# EAGLE schematic Erolf (EAGLE 6.5.0)

## Sheet 1 of 13
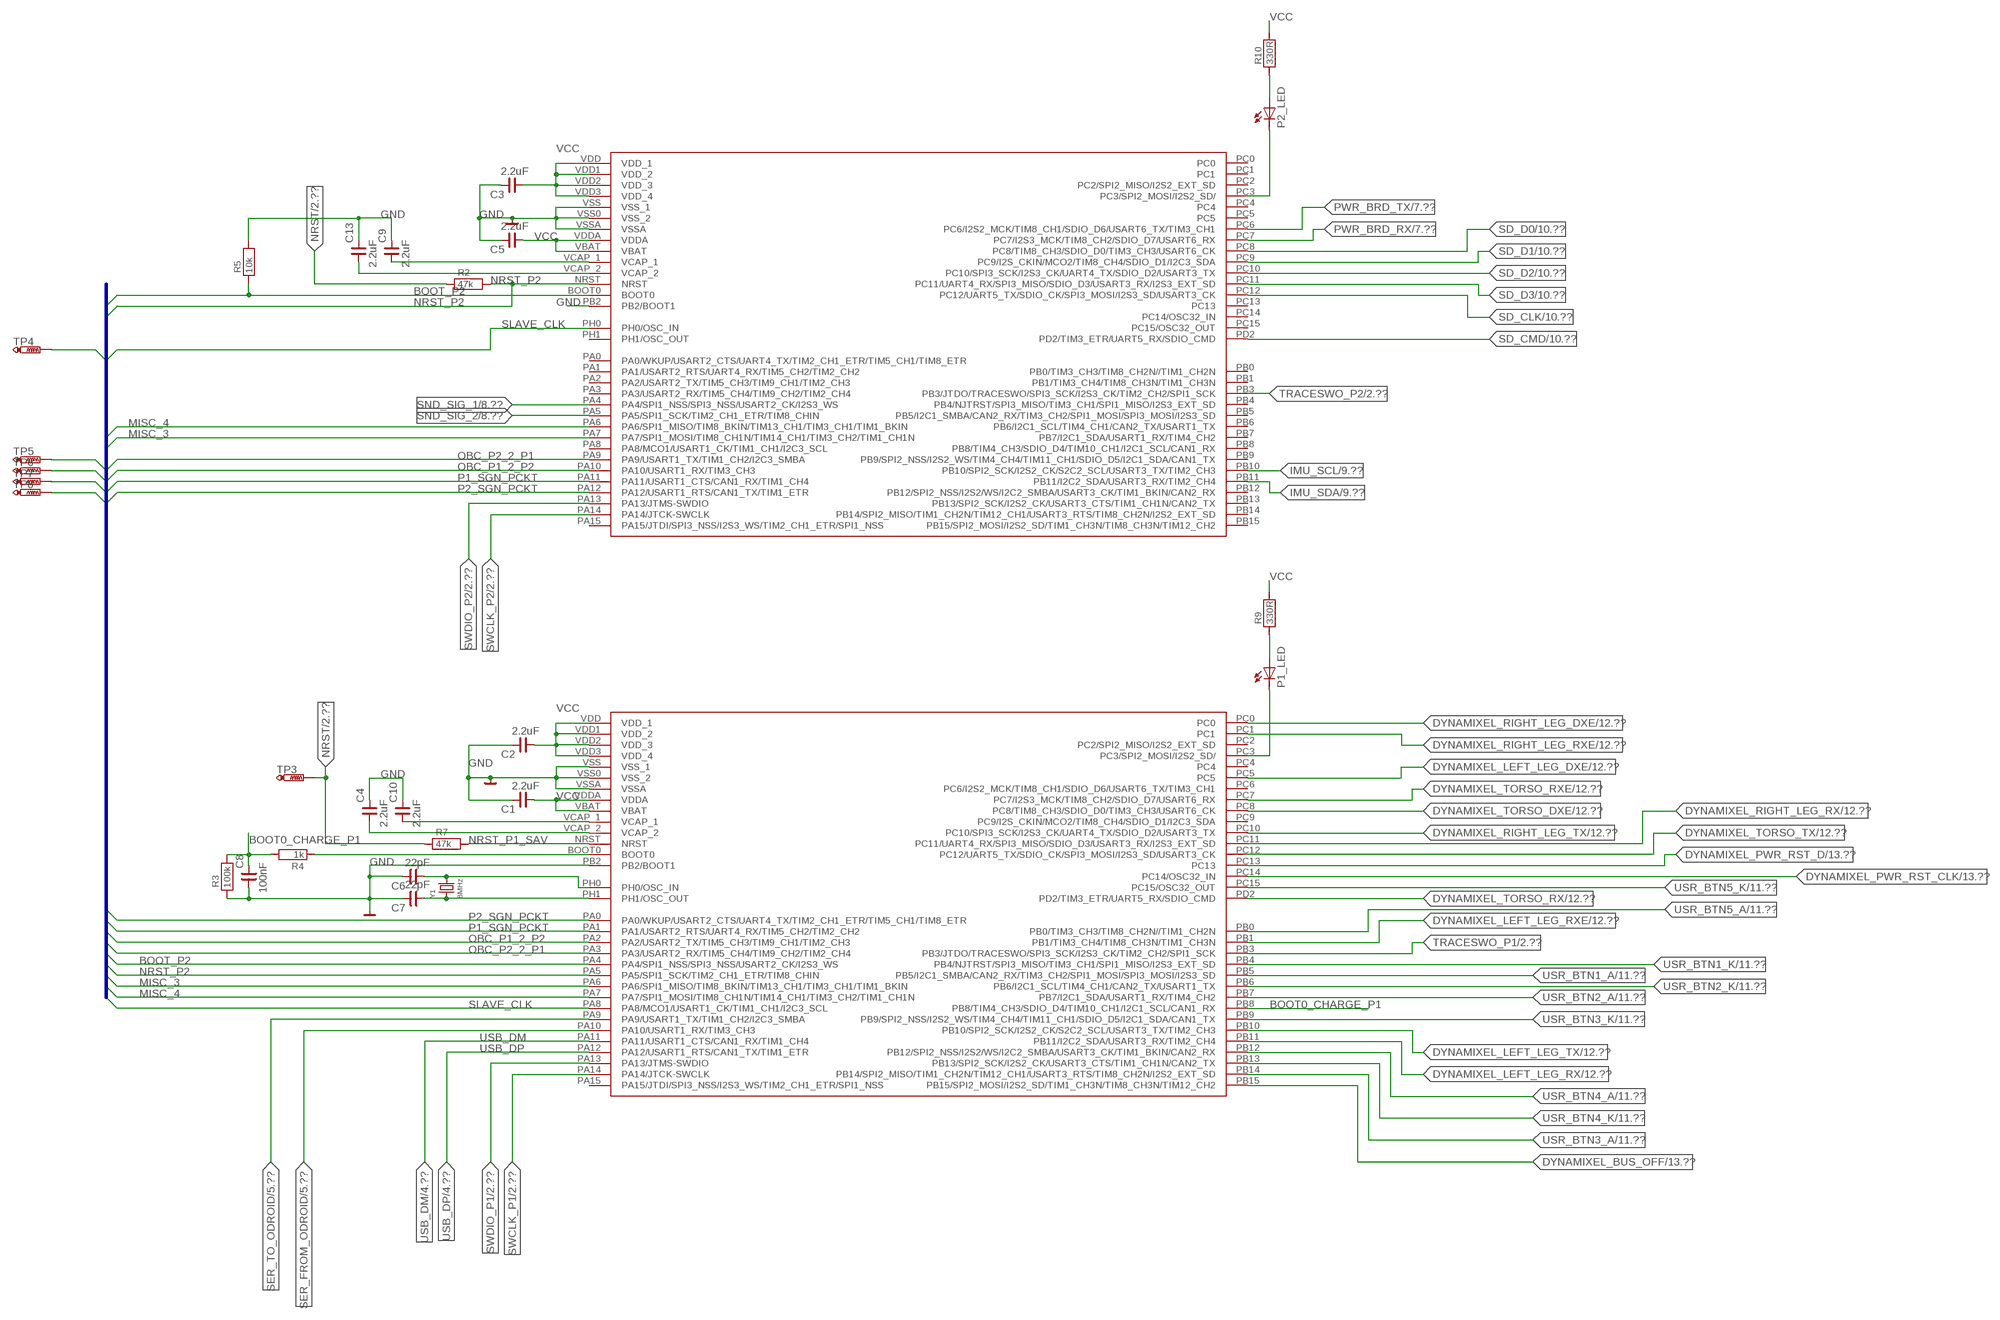
[diagram p0: schematic, sheet 1]

### Parts
C1  2.2uF  C_0603  [C0603]
C2  2.2uF  C_0603  [C0603]
C3  2.2uF  C_0603  [C0603]
C4  2.2uF  C_0603  [C0603]
C5  2.2uF  C_0603  [C0603]
C6  22pF  C_0603  [C0603]
C7  22pF  C_0603  [C0603]
C8  100nF  C_0603  [C0603]
C9  2.2uF  C_0603  [C0603]
C10  2.2uF  C_0603  [C0603]
C13  2.2uF  C_0603  [C0603]
P1_LED  LEDCHIP-LED0805  [CHIP-LED0805]
P2_LED  LEDCHIP-LED0805  [CHIP-LED0805]
PROCESSOR_1  STM32-F405RB  [LQFP-64]
PROCESSOR_2  STM32-F405RB  [LQFP-64]
R2  47k  R0603  [R0603]
R3  100k  R0603  [R0603]
R4  1k  R0603  [R0603]
R5  10k  R0603  [R0603]
R7  47k  R0603  [R0603]
R9  330R  R0603  [R0603]
R10  330R  R0603  [R0603]
TP3  PTR1TP06R  [TP06R]
TP4  PTR1TP06R  [TP06R]
TP5  PTR1TP06R  [TP06R]
TP6  PTR1TP06R  [TP06R]
TP7  PTR1TP06R  [TP06R]
TP8  PTR1TP06R  [TP06R]
Y1  8MHz  CRYSTALTHIN32K  [CRYSTAL_4.9X1.8]

### Nets
BOOT0_CHARGE_P1: C8.2 PROCESSOR_1.PB8(PB8/TIM4_CH3/SDIO_D4/TIM10_CH1/I2C1_SCL/CAN1_RX) R3.2 R4.2
BOOT_P2: PROCESSOR_1.PA4(PA4/SPI1_NSS/SPI3_NSS/USART2_CK/I2S3_WS) PROCESSOR_2.BOOT0 R5.1
DYNAMIXEL_BUS_OFF: PROCESSOR_1.PB15(PB15/SPI2_MOSI/I2S2_SD/TIM1_CH3N/TIM8_CH3N/TIM12_CH2) ; also sheet 13
DYNAMIXEL_LEFT_LEG_DXE: PROCESSOR_1.PC5 ; also sheet 12
DYNAMIXEL_LEFT_LEG_RX: PROCESSOR_1.PB11(PB11/I2C2_SDA/USART3_RX/TIM2_CH4) ; also sheet 12
DYNAMIXEL_LEFT_LEG_RXE: PROCESSOR_1.PB1(PB1/TIM3_CH4/TIM8_CH3N/TIM1_CH3N) ; also sheet 12
DYNAMIXEL_LEFT_LEG_TX: PROCESSOR_1.PB10(PB10/SPI2_SCK/I2S2_CK/S2C2_SCL/USART3_TX/TIM2_CH3) ; also sheet 12
DYNAMIXEL_PWR_RST_CLK: PROCESSOR_1.PC14(PC14/OSC32_IN) ; also sheet 13
DYNAMIXEL_PWR_RST_D: PROCESSOR_1.PC13 ; also sheet 13
DYNAMIXEL_RIGHT_LEG_DXE: PROCESSOR_1.PC0 ; also sheet 12
DYNAMIXEL_RIGHT_LEG_RX: PROCESSOR_1.PC11(PC11/UART4_RX/SPI3_MISO/SDIO_D3/USART3_RX/I2S3_EXT_SD) ; also sheet 12
DYNAMIXEL_RIGHT_LEG_RXE: PROCESSOR_1.PC1 ; also sheet 12
DYNAMIXEL_RIGHT_LEG_TX: PROCESSOR_1.PC10(PC10/SPI3_SCK/I2S3_CK/UART4_TX/SDIO_D2/USART3_TX) ; also sheet 12
DYNAMIXEL_TORSO_DXE: PROCESSOR_1.PC8(PC8/TIM8_CH3/SDIO_D0/TIM3_CH3/USART6_CK) ; also sheet 12
DYNAMIXEL_TORSO_RX: PROCESSOR_1.PD2(PD2/TIM3_ETR/UART5_RX/SDIO_CMD) ; also sheet 12
DYNAMIXEL_TORSO_RXE: PROCESSOR_1.PC7(PC7/I2S3_MCK/TIM8_CH2/SDIO_D7/USART6_RX) ; also sheet 12
DYNAMIXEL_TORSO_TX: PROCESSOR_1.PC12(PC12/UART5_TX/SDIO_CK/SPI3_MOSI/I2S3_SD/USART3_CK) ; also sheet 12
GND: C1.2 C2.2 C3.2 C4.2 C5.2 C6.2 C7.2 C8.1 C9.2 C10.2 C13.2 PROCESSOR_1.PB2(PB2/BOOT1) PROCESSOR_1.VSS0(VSS_2) PROCESSOR_1.VSS(VSS_1) PROCESSOR_1.VSSA PROCESSOR_2.PB2(PB2/BOOT1) PROCESSOR_2.VSS0(VSS_2) PROCESSOR_2.VSS(VSS_1) PROCESSOR_2.VSSA R3.1 R5.2 ; supply symbol labelled VG ; also sheet 2,4,5,6,7,9,10,12,13
IMU_SCL: PROCESSOR_2.PB10(PB10/SPI2_SCK/I2S2_CK/S2C2_SCL/USART3_TX/TIM2_CH3) ; also sheet 9
IMU_SDA: PROCESSOR_2.PB11(PB11/I2C2_SDA/USART3_RX/TIM2_CH4) ; also sheet 9
MISC_3: PROCESSOR_1.PA6(PA6/SPI1_MISO/TIM8_BKIN/TIM13_CH1/TIM3_CH1/TIM1_BKIN) PROCESSOR_2.PA7(PA7/SPI1_MOSI/TIM8_CH1N/TIM14_CH1/TIM3_CH2/TIM1_CH1N)
MISC_4: PROCESSOR_1.PA7(PA7/SPI1_MOSI/TIM8_CH1N/TIM14_CH1/TIM3_CH2/TIM1_CH1N) PROCESSOR_2.PA6(PA6/SPI1_MISO/TIM8_BKIN/TIM13_CH1/TIM3_CH1/TIM1_BKIN)
N$1: C10.1 PROCESSOR_1.VCAP_1
N$3: P1_LED.A R9.1
N$4: P2_LED.A R10.1
N$5: P1_LED.C PROCESSOR_1.PC3(PC3/SPI2_MOSI/I2S2_SD/)
N$7: C13.1 PROCESSOR_2.VCAP_2
N$8: C9.1 PROCESSOR_2.VCAP_1
N$9: PROCESSOR_1.BOOT0 R4.1
N$10: P2_LED.C PROCESSOR_2.PC3(PC3/SPI2_MOSI/I2S2_SD/)
N$43: C4.1 PROCESSOR_1.VCAP_2
NRST: R2.1 R7.1 TP3.TP ; also sheet 2,6
NRST_P1_SAV: PROCESSOR_1.NRST R7.2
NRST_P2: PROCESSOR_1.PA5(PA5/SPI1_SCK/TIM2_CH1_ETR/TIM8_CHIN) PROCESSOR_2.NRST R2.2
OBC_P1_2_P2: PROCESSOR_1.PA2(PA2/USART2_TX/TIM5_CH3/TIM9_CH1/TIM2_CH3) PROCESSOR_2.PA10(PA10/USART1_RX/TIM3_CH3) TP6.TP
OBC_P2_2_P1: PROCESSOR_1.PA3(PA3/USART2_RX/TIM5_CH4/TIM9_CH2/TIM2_CH4) PROCESSOR_2.PA9(PA9/USART1_TX/TIM1_CH2/I2C3_SMBA) TP5.TP
OSC_IN: C6.1 PROCESSOR_1.PH0(PH0/OSC_IN) Y1.2
OSC_OUT: C7.1 PROCESSOR_1.PH1(PH1/OSC_OUT) Y1.1
P1_SGN_PCKT: PROCESSOR_1.PA1(PA1/USART2_RTS/UART4_RX/TIM5_CH2/TIM2_CH2) PROCESSOR_2.PA11(PA11/USART1_CTS/CAN1_RX/TIM1_CH4) TP7.TP
P2_SGN_PCKT: PROCESSOR_1.PA0(PA0/WKUP/USART2_CTS/UART4_TX/TIM2_CH1_ETR/TIM5_CH1/TIM8_ETR) PROCESSOR_2.PA12(PA12/USART1_RTS/CAN1_TX/TIM1_ETR) TP8.TP
PWR_BRD_RX: PROCESSOR_2.PC7(PC7/I2S3_MCK/TIM8_CH2/SDIO_D7/USART6_RX) ; also sheet 7
PWR_BRD_TX: PROCESSOR_2.PC6(PC6/I2S2_MCK/TIM8_CH1/SDIO_D6/USART6_TX/TIM3_CH1) ; also sheet 7
SD_CLK: PROCESSOR_2.PC12(PC12/UART5_TX/SDIO_CK/SPI3_MOSI/I2S3_SD/USART3_CK) ; also sheet 10
SD_CMD: PROCESSOR_2.PD2(PD2/TIM3_ETR/UART5_RX/SDIO_CMD) ; also sheet 10
SD_D0: PROCESSOR_2.PC8(PC8/TIM8_CH3/SDIO_D0/TIM3_CH3/USART6_CK) ; also sheet 10
SD_D1: PROCESSOR_2.PC9(PC9/I2S_CKIN/MCO2/TIM8_CH4/SDIO_D1/I2C3_SDA) ; also sheet 10
SD_D2: PROCESSOR_2.PC10(PC10/SPI3_SCK/I2S3_CK/UART4_TX/SDIO_D2/USART3_TX) ; also sheet 10
SD_D3: PROCESSOR_2.PC11(PC11/UART4_RX/SPI3_MISO/SDIO_D3/USART3_RX/I2S3_EXT_SD) ; also sheet 10
SER_FROM_ODROID: PROCESSOR_1.PA10(PA10/USART1_RX/TIM3_CH3) ; also sheet 5
SER_TO_ODROID: PROCESSOR_1.PA9(PA9/USART1_TX/TIM1_CH2/I2C3_SMBA) ; also sheet 5
SLAVE_CLK: PROCESSOR_1.PA8(PA8/MCO1/USART1_CK/TIM1_CH1/I2C3_SCL) PROCESSOR_2.PH0(PH0/OSC_IN) TP4.TP
SND_SIG_1: PROCESSOR_2.PA4(PA4/SPI1_NSS/SPI3_NSS/USART2_CK/I2S3_WS) ; also sheet 8
SND_SIG_2: PROCESSOR_2.PA5(PA5/SPI1_SCK/TIM2_CH1_ETR/TIM8_CHIN) ; also sheet 8
SWCLK_P1: PROCESSOR_1.PA14(PA14/JTCK-SWCLK) ; also sheet 2
SWCLK_P2: PROCESSOR_2.PA14(PA14/JTCK-SWCLK) ; also sheet 2
SWDIO_P1: PROCESSOR_1.PA13(PA13/JTMS-SWDIO) ; also sheet 2
SWDIO_P2: PROCESSOR_2.PA13(PA13/JTMS-SWDIO) ; also sheet 2
TRACESWO_P1: PROCESSOR_1.PB3(PB3/JTDO/TRACESWO/SPI3_SCK/I2S3_CK/TIM2_CH2/SPI1_SCK) ; also sheet 2
TRACESWO_P2: PROCESSOR_2.PB3(PB3/JTDO/TRACESWO/SPI3_SCK/I2S3_CK/TIM2_CH2/SPI1_SCK) ; also sheet 2
USB_DM: PROCESSOR_1.PA11(PA11/USART1_CTS/CAN1_RX/TIM1_CH4) ; also sheet 4
USB_DP: PROCESSOR_1.PA12(PA12/USART1_RTS/CAN1_TX/TIM1_ETR) ; also sheet 4
USR_BTN1_A: PROCESSOR_1.PB5(PB5/I2C1_SMBA/CAN2_RX/TIM3_CH2/SPI1_MOSI/SPI3_MOSI/I2S3_SD) ; also sheet 11
USR_BTN1_K: PROCESSOR_1.PB4(PB4/NJTRST/SPI3_MISO/TIM3_CH1/SPI1_MISO/I2S3_EXT_SD) ; also sheet 11
USR_BTN2_A: PROCESSOR_1.PB7(PB7/I2C1_SDA/USART1_RX/TIM4_CH2) ; also sheet 11
USR_BTN2_K: PROCESSOR_1.PB6(PB6/I2C1_SCL/TIM4_CH1/CAN2_TX/USART1_TX) ; also sheet 11
USR_BTN3_A: PROCESSOR_1.PB14(PB14/SPI2_MISO/TIM1_CH2N/TIM12_CH1/USART3_RTS/TIM8_CH2N/I2S2_EXT_SD) ; also sheet 11
USR_BTN3_K: PROCESSOR_1.PB9(PB9/SPI2_NSS/I2S2_WS/TIM4_CH4/TIM11_CH1/SDIO_D5/I2C1_SDA/CAN1_TX) ; also sheet 11
USR_BTN4_A: PROCESSOR_1.PB12(PB12/SPI2_NSS/I2S2/WS/I2C2_SMBA/USART3_CK/TIM1_BKIN/CAN2_RX) ; also sheet 11
USR_BTN4_K: PROCESSOR_1.PB13(PB13/SPI2_SCK/I2S2_CK/USART3_CTS/TIM1_CH1N/CAN2_TX) ; also sheet 11
USR_BTN5_A: PROCESSOR_1.PB0(PB0/TIM3_CH3/TIM8_CH2N//TIM1_CH2N) ; also sheet 11
USR_BTN5_K: PROCESSOR_1.PC15(PC15/OSC32_OUT) ; also sheet 11
VCC: C1.1 C2.1 C3.1 C5.1 PROCESSOR_1.VBAT PROCESSOR_1.VDD1(VDD_2) PROCESSOR_1.VDD2(VDD_3) PROCESSOR_1.VDD3(VDD_4) PROCESSOR_1.VDD(VDD_1) PROCESSOR_1.VDDA PROCESSOR_2.VBAT PROCESSOR_2.VDD1(VDD_2) PROCESSOR_2.VDD2(VDD_3) PROCESSOR_2.VDD3(VDD_4) PROCESSOR_2.VDD(VDD_1) PROCESSOR_2.VDDA R9.2 R10.2 ; also sheet 2,5,6,7,9,10,11,12,13
Unconnected: PROCESSOR_1.PA15(PA15/JTDI/SPI3_NSS/I2S3_WS/TIM2_CH1_ETR/SPI1_NSS) PROCESSOR_1.PC2(PC2/SPI2_MISO/I2S2_EXT_SD) PROCESSOR_1.PC4 PROCESSOR_1.PC6(PC6/I2S2_MCK/TIM8_CH1/SDIO_D6/USART6_TX/TIM3_CH1) PROCESSOR_1.PC9(PC9/I2S_CKIN/MCO2/TIM8_CH4/SDIO_D1/I2C3_SDA) PROCESSOR_2.PA0(PA0/WKUP/USART2_CTS/UART4_TX/TIM2_CH1_ETR/TIM5_CH1/TIM8_ETR) PROCESSOR_2.PA1(PA1/USART2_RTS/UART4_RX/TIM5_CH2/TIM2_CH2) PROCESSOR_2.PA2(PA2/USART2_TX/TIM5_CH3/TIM9_CH1/TIM2_CH3) PROCESSOR_2.PA3(PA3/USART2_RX/TIM5_CH4/TIM9_CH2/TIM2_CH4) PROCESSOR_2.PA8(PA8/MCO1/USART1_CK/TIM1_CH1/I2C3_SCL) PROCESSOR_2.PA15(PA15/JTDI/SPI3_NSS/I2S3_WS/TIM2_CH1_ETR/SPI1_NSS) PROCESSOR_2.PB0(PB0/TIM3_CH3/TIM8_CH2N//TIM1_CH2N) PROCESSOR_2.PB1(PB1/TIM3_CH4/TIM8_CH3N/TIM1_CH3N) PROCESSOR_2.PB4(PB4/NJTRST/SPI3_MISO/TIM3_CH1/SPI1_MISO/I2S3_EXT_SD) PROCESSOR_2.PB5(PB5/I2C1_SMBA/CAN2_RX/TIM3_CH2/SPI1_MOSI/SPI3_MOSI/I2S3_SD) PROCESSOR_2.PB6(PB6/I2C1_SCL/TIM4_CH1/CAN2_TX/USART1_TX) PROCESSOR_2.PB7(PB7/I2C1_SDA/USART1_RX/TIM4_CH2) PROCESSOR_2.PB8(PB8/TIM4_CH3/SDIO_D4/TIM10_CH1/I2C1_SCL/CAN1_RX) PROCESSOR_2.PB9(PB9/SPI2_NSS/I2S2_WS/TIM4_CH4/TIM11_CH1/SDIO_D5/I2C1_SDA/CAN1_TX) PROCESSOR_2.PB12(PB12/SPI2_NSS/I2S2/WS/I2C2_SMBA/USART3_CK/TIM1_BKIN/CAN2_RX) PROCESSOR_2.PB13(PB13/SPI2_SCK/I2S2_CK/USART3_CTS/TIM1_CH1N/CAN2_TX) PROCESSOR_2.PB14(PB14/SPI2_MISO/TIM1_CH2N/TIM12_CH1/USART3_RTS/TIM8_CH2N/I2S2_EXT_SD) PROCESSOR_2.PB15(PB15/SPI2_MOSI/I2S2_SD/TIM1_CH3N/TIM8_CH3N/TIM12_CH2) PROCESSOR_2.PC0 PROCESSOR_2.PC1 PROCESSOR_2.PC2(PC2/SPI2_MISO/I2S2_EXT_SD) PROCESSOR_2.PC4 PROCESSOR_2.PC5 PROCESSOR_2.PC13 PROCESSOR_2.PC14(PC14/OSC32_IN) PROCESSOR_2.PC15(PC15/OSC32_OUT) PROCESSOR_2.PH1(PH1/OSC_OUT)

### Buses
SLAVE_CLK,OBC_P1_2_P2,OBC_P2_2_P1,P1_SGN_PCKT,P2_SGN_PCKT,MISC_1,MISC_2,MISC_3,MISC_4,MISC_5,MISC_6,MISC_7,MISC_8,MISC_9,MISC_10,NRST_P2,BOOT_P2

## Sheet 2 of 13
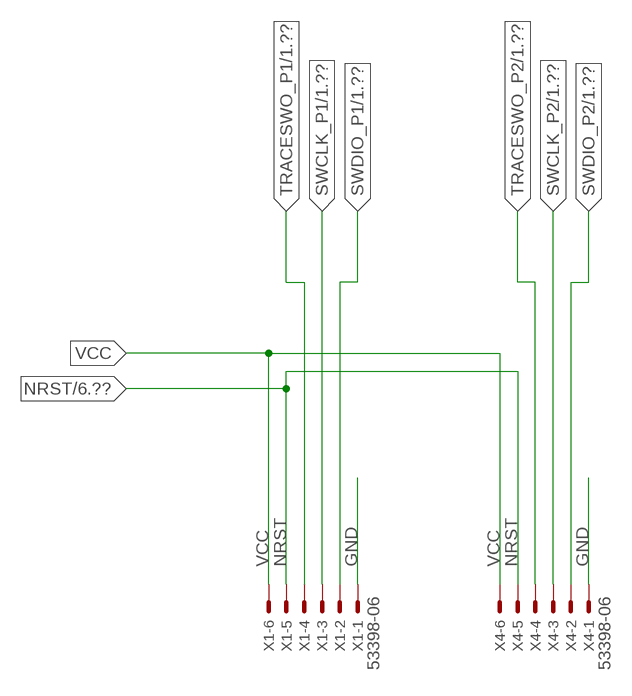
[diagram p1: schematic, sheet 2]

### Parts
X1  53398-06  [53398-06]
X4  53398-06  [53398-06]

### Nets
GND: X1.1 X4.1 ; also sheet 1,4,5,6,7,9,10,12,13
NRST: X1.5 X4.5 ; also sheet 1,6
SWCLK_P1: X1.3 ; also sheet 1
SWCLK_P2: X4.3 ; also sheet 1
SWDIO_P1: X1.2 ; also sheet 1
SWDIO_P2: X4.2 ; also sheet 1
TRACESWO_P1: X1.4 ; also sheet 1
TRACESWO_P2: X4.4 ; also sheet 1
VCC: X1.6 X4.6 ; also sheet 1,5,6,7,9,10,11,12,13

## Sheet 3 of 13
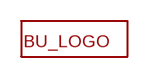
[diagram p2: schematic, sheet 3]

### Parts
U$8  LOGO  [LOGO]

## Sheet 4 of 13
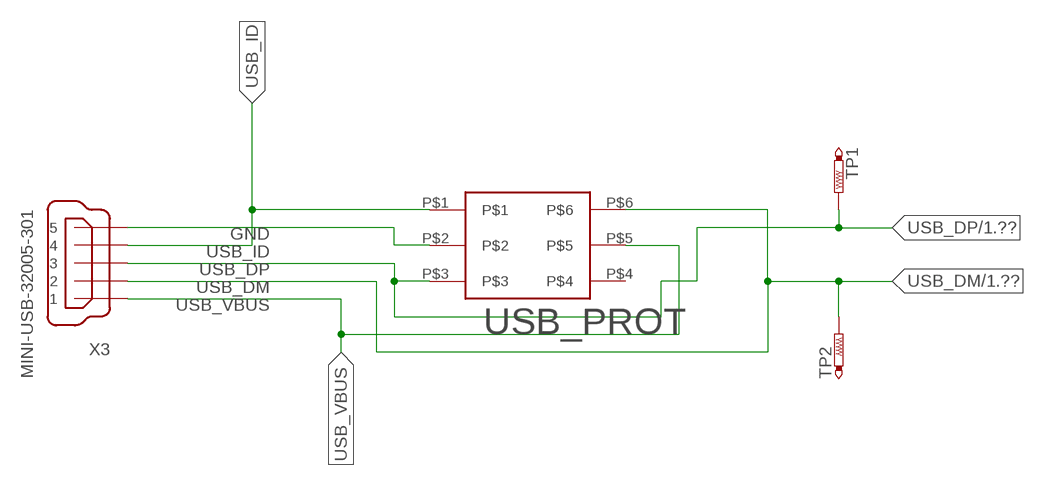
[diagram p3: schematic, sheet 4]

### Parts
TP1  PTR1TP06R  [TP06R]
TP2  PTR1TP06R  [TP06R]
USB_PROT  VBUS054B  [LLP75-6L]
X3  MINI-USB-32005-301  [32005-301]

### Nets
GND: USB_PROT.P$2 X3.5 ; also sheet 1,2,5,6,7,9,10,12,13
USB_DM: TP2.TP USB_PROT.P$6 X3.2 ; also sheet 1
USB_DP: TP1.TP USB_PROT.P$3 X3.3 ; also sheet 1
USB_ID: USB_PROT.P$1 X3.4
USB_VBUS: USB_PROT.P$5 X3.1
Unconnected: USB_PROT.P$4

## Sheet 5 of 13
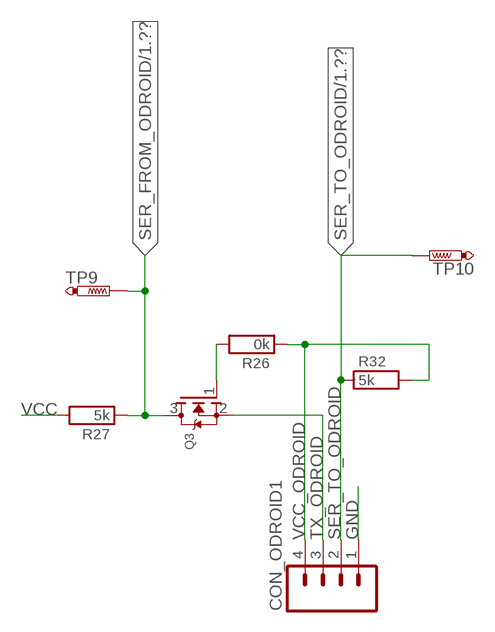
[diagram p4: schematic, sheet 5]

### Parts
CON_ODROID1  M04  [04P]
Q3  MOSFET-NREFLOW  [SOT23]
R26  0k  R0603  [R0603]
R27  5k  R0603  [R0603]
R32  5k  R0603  [R0603]
TP9  PTR1TP06R  [TP06R]
TP10  PTR1TP06R  [TP06R]

### Nets
GND: CON_ODROID1.1 ; also sheet 1,2,4,6,7,9,10,12,13
N$15: Q3.1(G) R26.2
SER_FROM_ODROID: Q3.3(D) R27.1 TP9.TP ; also sheet 1
SER_TO_ODROID: CON_ODROID1.2 R32.1 TP10.TP ; also sheet 1
TX_ODROID: CON_ODROID1.3 Q3.2(S)
VCC: R27.2 ; also sheet 1,2,6,7,9,10,11,12,13
VCC_ODROID: CON_ODROID1.4 R26.1 R32.2

## Sheet 6 of 13
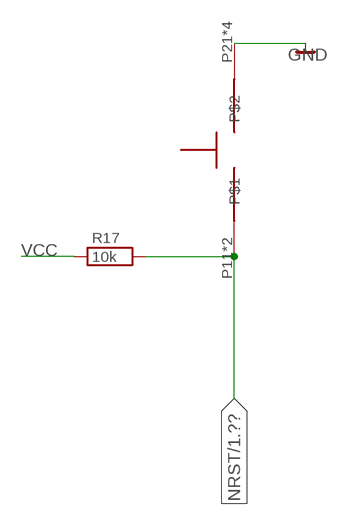
[diagram p5: schematic, sheet 6]

### Parts
R17  10k  R0603  [R0603]
U$3  BUTTON  [BUTTON]

### Nets
GND: U$3.P21 U$3.P22 U$3.P23 U$3.P24 ; supply symbol labelled VG ; also sheet 1,2,4,5,7,9,10,12,13
NRST: R17.2 U$3.P11 U$3.P12 ; also sheet 1,2
VCC: R17.1 ; also sheet 1,2,5,7,9,10,11,12,13

## Sheet 7 of 13
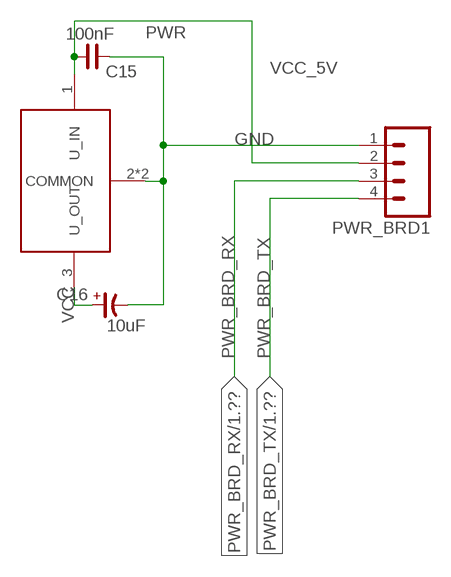
[diagram p6: schematic, sheet 7]

### Parts
BLUBB  UA78M00  [SOT223-4]
C15  100nF  C_0603  [C0603]
C16  10uF  CP_E-025X060  [CE-025X060]
PWR_BRD1  M04  [04P]

### Nets
GND: BLUBB.2(COMMON) BLUBB.4(COMMON) C15.2 C16.- PWR_BRD1.1 ; also sheet 1,2,4,5,6,9,10,12,13
PWR_BRD_RX: PWR_BRD1.3 ; also sheet 1
PWR_BRD_TX: PWR_BRD1.4 ; also sheet 1
VCC: BLUBB.3(U_OUT) C16.+ ; also sheet 1,2,5,6,9,10,11,12,13
VCC_5V: BLUBB.1(U_IN) C15.1 PWR_BRD1.2 ; also sheet 8

### Notes on the sheet
- PWR

## Sheet 8 of 13
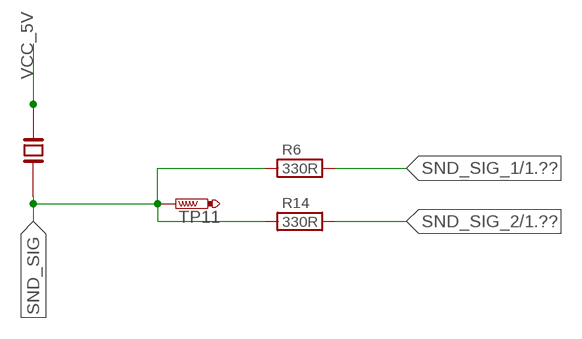
[diagram p7: schematic, sheet 8]

### Parts
R6  330R  R0603  [R0603]
R14  330R  R0603  [R0603]
TP11  PTR1TP06R  [TP06R]
U$1  PS1240P02CT3  [PS1240P02CT3]

### Nets
SND_SIG: R6.1 R14.1 TP11.TP U$1.P$2
SND_SIG_1: R6.2 ; also sheet 1
SND_SIG_2: R14.2 ; also sheet 1
VCC_5V: U$1.P$1 ; also sheet 7

## Sheet 9 of 13
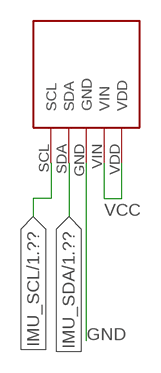
[diagram p8: schematic, sheet 9]

### Parts
U$4  MINI-IMU-9V2  [PCB]

### Nets
GND: U$4.GND ; also sheet 1,2,4,5,6,7,10,12,13
IMU_SCL: U$4.SCL ; also sheet 1
IMU_SDA: U$4.SDA ; also sheet 1
VCC: U$4.VDD U$4.VIN ; also sheet 1,2,5,6,7,10,11,12,13

## Sheet 10 of 13
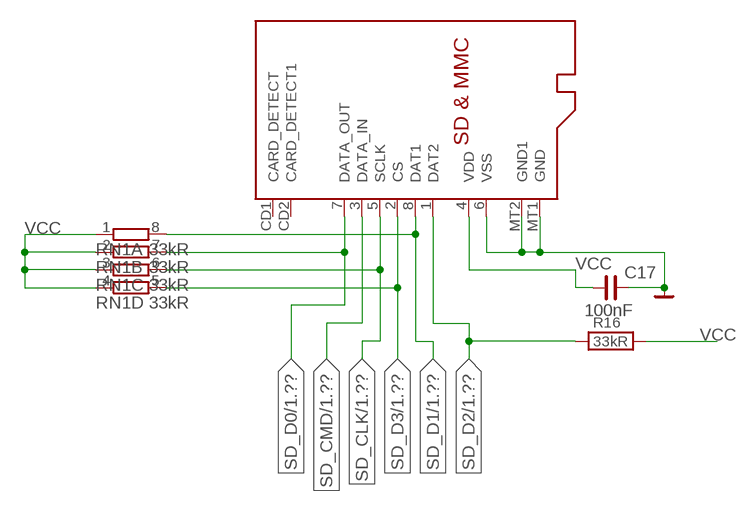
[diagram p9: schematic, sheet 10]

### Parts
C17  100nF  C_0603  [C0603]
R16  33kR  R0603  [R0603]
RN1  33kR  4R-NEXBS8V  [EXBS8V]
U$2  MICROSD  [MICROSD]

### Nets
GND: C17.2 U$2.6(VSS) U$2.MT1(GND) U$2.MT2(GND1) ; supply symbol labelled VG ; also sheet 1,2,4,5,6,7,9,12,13
SD_CLK: RN1.6 U$2.5(SCLK) ; also sheet 1
SD_CMD: U$2.3(DATA_IN) ; also sheet 1
SD_D0: RN1.7 U$2.7(DATA_OUT) ; also sheet 1
SD_D1: RN1.8 U$2.8(DAT1) ; also sheet 1
SD_D2: R16.1 U$2.1(DAT2) ; also sheet 1
SD_D3: RN1.5 U$2.2(CS) ; also sheet 1
VCC: C17.1 R16.2 RN1.1 RN1.2 RN1.3 RN1.4 U$2.4(VDD) ; also sheet 1,2,5,6,7,9,11,12,13
Unconnected: U$2.CD1(CARD_DETECT) U$2.CD2(CARD_DETECT1)

## Sheet 11 of 13
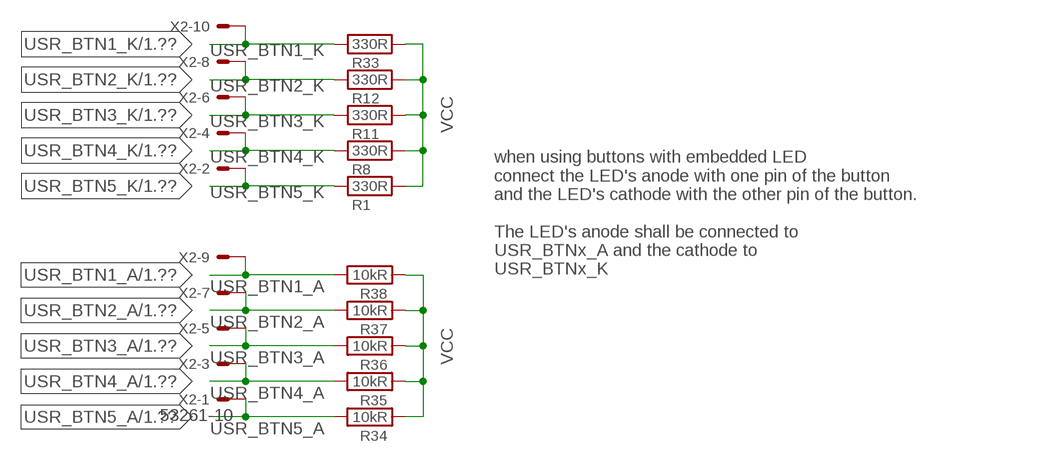
[diagram p10: schematic, sheet 11]

### Parts
R1  330R  R0603  [R0603]
R8  330R  R0603  [R0603]
R11  330R  R0603  [R0603]
R12  330R  R0603  [R0603]
R33  330R  R0603  [R0603]
R34  10kR  R0603  [R0603]
R35  10kR  R0603  [R0603]
R36  10kR  R0603  [R0603]
R37  10kR  R0603  [R0603]
R38  10kR  R0603  [R0603]
X2  53261-10  [53261-10]

### Nets
USR_BTN1_A: R38.2 X2.9 ; also sheet 1
USR_BTN1_K: R33.1 X2.10 ; also sheet 1
USR_BTN2_A: R37.2 X2.7 ; also sheet 1
USR_BTN2_K: R12.1 X2.8 ; also sheet 1
USR_BTN3_A: R36.2 X2.5 ; also sheet 1
USR_BTN3_K: R11.1 X2.6 ; also sheet 1
USR_BTN4_A: R35.2 X2.3 ; also sheet 1
USR_BTN4_K: R8.1 X2.4 ; also sheet 1
USR_BTN5_A: R34.2 X2.1 ; also sheet 1
USR_BTN5_K: R1.1 X2.2 ; also sheet 1
VCC: R1.2 R8.2 R11.2 R12.2 R33.2 R34.1 R35.1 R36.1 R37.1 R38.1 ; also sheet 1,2,5,6,7,9,10,12,13

### Notes on the sheet
- when using buttons with embedded LED 
  connect the LED's anode with one pin of the button
  and the LED's cathode with the other pin of the button.
  
  The LED's anode shall be connected to 
  USR_BTNx_A and the cathode to
  USR_BTNx_K

## Sheet 12 of 13
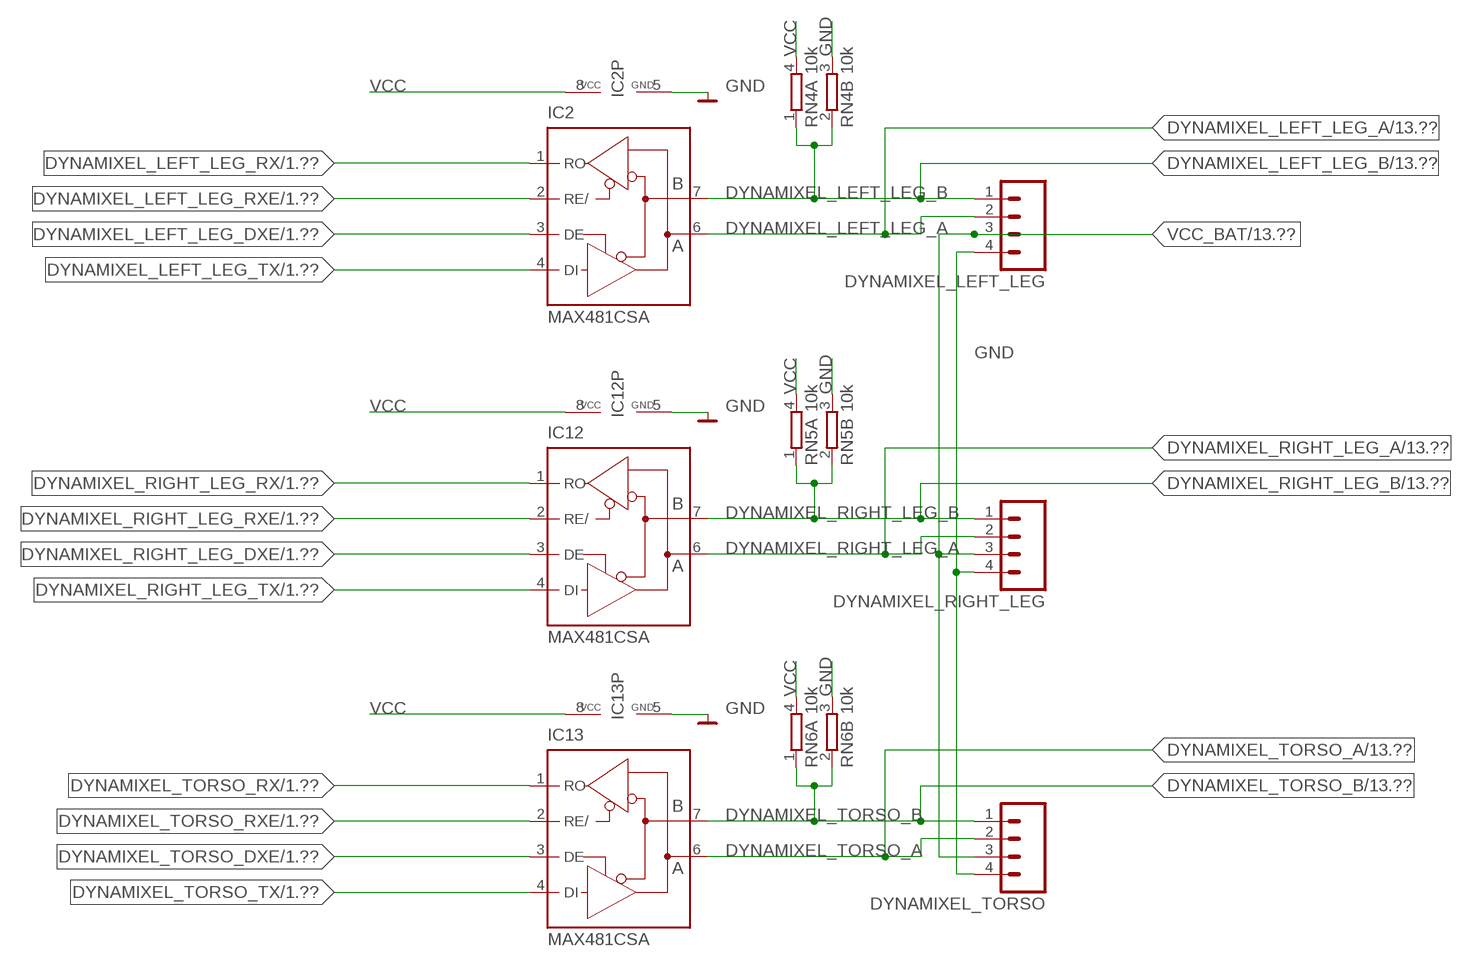
[diagram p11: schematic, sheet 12]

### Parts
DYNAMIXEL_LEFT_LEG  M04  [04P]
DYNAMIXEL_RIGHT_LEG  M04  [04P]
DYNAMIXEL_TORSO  M04  [04P]
IC2  MAX481CSA  [SO08]
IC12  MAX481CSA  [SO08]
IC13  MAX481CSA  [SO08]
RN4  10k  2R-NEXBV4V  [EXBV4V]
RN5  10k  2R-NEXBV4V  [EXBV4V]
RN6  10k  2R-NEXBV4V  [EXBV4V]

### Nets
DYNAMIXEL_LEFT_LEG_A: DYNAMIXEL_LEFT_LEG.2 IC2.6(A) ; also sheet 13
DYNAMIXEL_LEFT_LEG_B: DYNAMIXEL_LEFT_LEG.1 IC2.7(B) RN4.1 RN4.2 ; also sheet 13
DYNAMIXEL_LEFT_LEG_DXE: IC2.3(DE) ; also sheet 1
DYNAMIXEL_LEFT_LEG_RX: IC2.1(RO) ; also sheet 1
DYNAMIXEL_LEFT_LEG_RXE: IC2.2(RE/) ; also sheet 1
DYNAMIXEL_LEFT_LEG_TX: IC2.4(DI) ; also sheet 1
DYNAMIXEL_RIGHT_LEG_A: DYNAMIXEL_RIGHT_LEG.2 IC12.6(A) ; also sheet 13
DYNAMIXEL_RIGHT_LEG_B: DYNAMIXEL_RIGHT_LEG.1 IC12.7(B) RN5.1 RN5.2 ; also sheet 13
DYNAMIXEL_RIGHT_LEG_DXE: IC12.3(DE) ; also sheet 1
DYNAMIXEL_RIGHT_LEG_RX: IC12.1(RO) ; also sheet 1
DYNAMIXEL_RIGHT_LEG_RXE: IC12.2(RE/) ; also sheet 1
DYNAMIXEL_RIGHT_LEG_TX: IC12.4(DI) ; also sheet 1
DYNAMIXEL_TORSO_A: DYNAMIXEL_TORSO.2 IC13.6(A) ; also sheet 13
DYNAMIXEL_TORSO_B: DYNAMIXEL_TORSO.1 IC13.7(B) RN6.1 RN6.2 ; also sheet 13
DYNAMIXEL_TORSO_DXE: IC13.3(DE) ; also sheet 1
DYNAMIXEL_TORSO_RX: IC13.1(RO) ; also sheet 1
DYNAMIXEL_TORSO_RXE: IC13.2(RE/) ; also sheet 1
DYNAMIXEL_TORSO_TX: IC13.4(DI) ; also sheet 1
GND: DYNAMIXEL_LEFT_LEG.4 DYNAMIXEL_RIGHT_LEG.4 DYNAMIXEL_TORSO.4 IC2.5(GND) IC12.5(GND) IC13.5(GND) RN4.3 RN5.3 RN6.3 ; supply symbol labelled VG ; also sheet 1,2,4,5,6,7,9,10,13
VCC: IC2.8(VCC) IC12.8(VCC) IC13.8(VCC) RN4.4 RN5.4 RN6.4 ; also sheet 1,2,5,6,7,9,10,11,13
VCC_BAT: DYNAMIXEL_LEFT_LEG.3 DYNAMIXEL_RIGHT_LEG.3 DYNAMIXEL_TORSO.3 ; also sheet 13

## Sheet 13 of 13
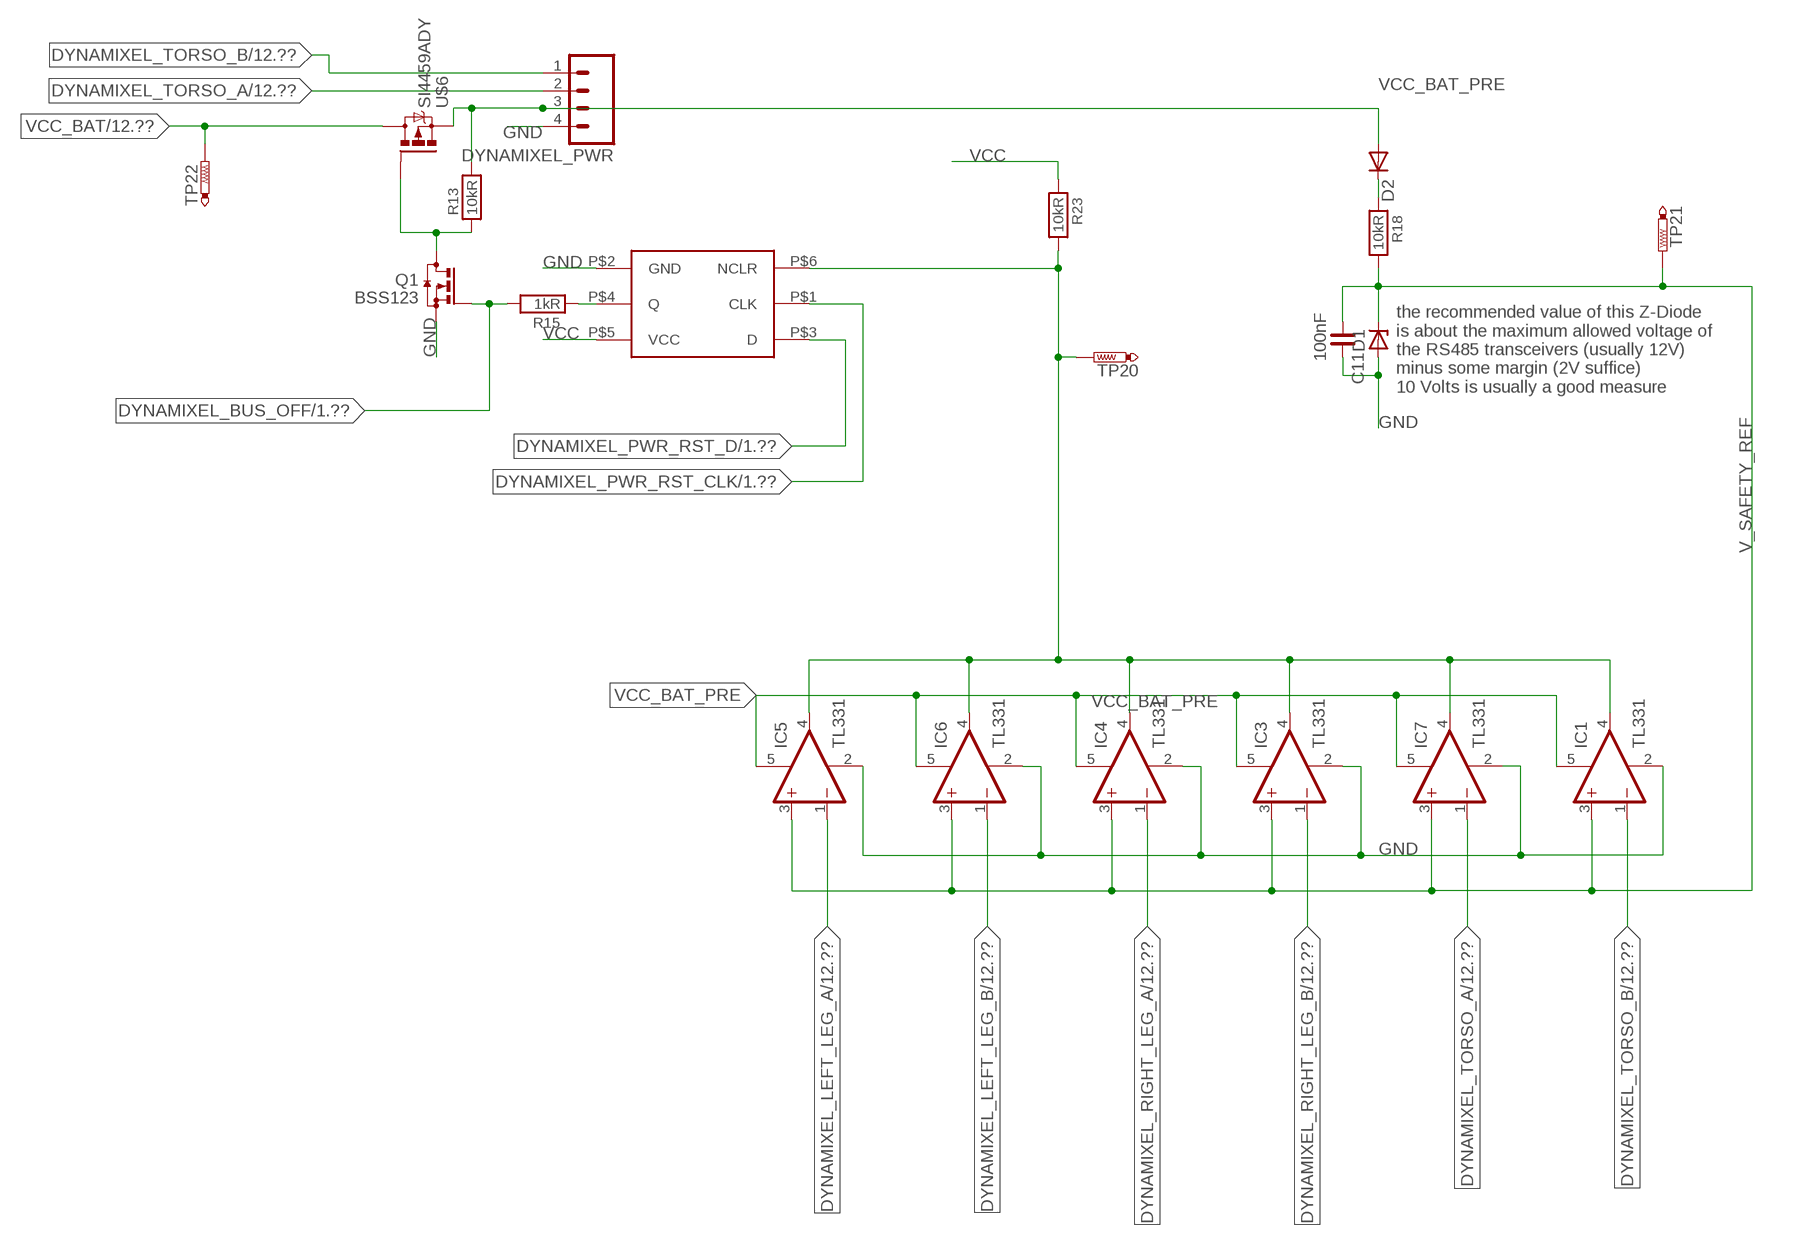
[diagram p12: schematic, sheet 13]

### Parts
C11  100nF  C_0603  [C0603]
D1  ZENER-DIODESOD80C  [SOD80C]
D2  DIODE-MICROMELF-R  [MICROMELF-R]
DYNAMIXEL_PWR  M04  [04P]
IC1  TL331  [DBV-R-PDSO-G5]
IC3  TL331  [DBV-R-PDSO-G5]
IC4  TL331  [DBV-R-PDSO-G5]
IC5  TL331  [DBV-R-PDSO-G5]
IC6  TL331  [DBV-R-PDSO-G5]
IC7  TL331  [DBV-R-PDSO-G5]
Q1  BSS123  [SOT23]
R13  10kR  R0603  [R0603]
R15  1kR  R0603  [R0603]
R18  10kR  R0603  [R0603]
R23  10kR  R0603  [R0603]
TP20  PTR1TP06R  [TP06R]
TP21  PTR1TP06R  [TP06R]
TP22  PTR1TP06R  [TP06R]
U$6  SI4459ADY  [SO-8]
U$7  SN74LVC1G175  [DCV_R-PDSO-6]

### Nets
DYNAMIXEL_BUS_OFF: Q1.1(G) R15.2 ; also sheet 1
DYNAMIXEL_BUS_OFF_AUTO_TRIG: IC1.4(OUT) IC3.4(OUT) IC4.4(OUT) IC5.4(OUT) IC6.4(OUT) IC7.4(OUT) R23.2 TP20.TP U$7.P$6(NCLR)
DYNAMIXEL_LEFT_LEG_A: IC5.1(-IN) ; also sheet 12
DYNAMIXEL_LEFT_LEG_B: IC6.1(-IN) ; also sheet 12
DYNAMIXEL_PWR_RST_CLK: U$7.P$1(CLK) ; also sheet 1
DYNAMIXEL_PWR_RST_D: U$7.P$3(D) ; also sheet 1
DYNAMIXEL_RIGHT_LEG_A: IC4.1(-IN) ; also sheet 12
DYNAMIXEL_RIGHT_LEG_B: IC3.1(-IN) ; also sheet 12
DYNAMIXEL_TORSO_A: DYNAMIXEL_PWR.2 IC7.1(-IN) ; also sheet 12
DYNAMIXEL_TORSO_B: DYNAMIXEL_PWR.1 IC1.1(-IN) ; also sheet 12
GND: C11.2 D1.A DYNAMIXEL_PWR.4 IC1.2(GND) IC3.2(GND) IC4.2(GND) IC5.2(GND) IC6.2(GND) IC7.2(GND) Q1.2(S) U$7.P$2(GND) ; also sheet 1,2,4,5,6,7,9,10,12
N$2: R15.1 U$7.P$4(Q)
N$11: Q1.3(D) R13.1 U$6.P4(G)
N$12: D2.C R18.1
V_SAFETY_REF: C11.1 D1.C IC1.3(+IN) IC3.3(+IN) IC4.3(+IN) IC5.3(+IN) IC6.3(+IN) IC7.3(+IN) R18.2 TP21.TP
VCC: R23.1 U$7.P$5(VCC) ; also sheet 1,2,5,6,7,9,10,11,12
VCC_BAT: TP22.TP U$6.P5(D) U$6.P6(D) U$6.P7(D) U$6.P8(D) ; also sheet 12
VCC_BAT_PRE: D2.A DYNAMIXEL_PWR.3 IC1.5(V+) IC3.5(V+) IC4.5(V+) IC5.5(V+) IC6.5(V+) IC7.5(V+) R13.2 U$6.P1(S) U$6.P2(S) U$6.P3(S)

### Notes on the sheet
- the recommended value of this Z-Diode
  is about the maximum allowed voltage of
  the RS485 transceivers (usually 12V)
  minus some margin (2V suffice)
  10 Volts is usually a good measure

## Library data of the parts
BLUBB = texas:UA78M00
C1-C11 C13 C15 C17 = rc-master:C_: NON-POLARIZED CAP
C16 = rc-master:CP_: POLARIZED CAP
CON_ODROID1 DYNAMIXEL_LEFT_LEG DYNAMIXEL_PWR DYNAMIXEL_RIGHT_LEG DYNAMIXEL_TORSO PWR_BRD1 = con-amp-quick:M04: AMP QUICK CONNECTOR; OC_FARNELL: unknown; OC_NEWARK: unknown
D1 = diode:ZENER-DIODE: Z-Diode
D2 = diode:DIODE-: DIODE
IC1 IC3-IC7 = linear:TL331: SINGLE DIFFERENTIAL COMPARATOR Source: Data sheet <http://www.ti.com/lit/ds/symlink/tl331-q1.pdf>
IC2 IC12 IC13 = maxim:MAX481CSA: RS485 TRANSEIVER; MF: MAXIM; MPN: MAX481CSA; OC_FARNELL: unknown; OC_NEWARK: 90C3817
P1_LED P2_LED = adafruit:LED: LED OSRAM: - CHIPLED LG R971, LG N971, LY N971, LG Q971, LY Q971, LO R971, LY R971 LH N974, LH R974 LS Q976, LO Q976, LY Q976 LO Q996 - Hyper CHIPLED LW Q18S LB Q993, LB Q99A, LB R99A - SideLED LS A670, LO A670, LY A670, LG A670, LP A670 LB A673, LV A673, LT A673, LW A673 LH A674 LY A675 LS A676, LA A676, LO A676, LY A676, LW A676 LS A679, LY A679, LG A679 - Hyper Micro SIDELED® LS Y876, LA Y876, LO Y876, LY Y876 LT Y87S - SmartLED LW L88C, LW L88S LB L89C, LB L89S, LG L890 LS L89K, LO L89K, LY L89K LS L896, LA L896, LO L896, LY L896 - TOPLED LS T670, LO T670, LY T670, LG T670, LP T670 LSG T670, LSP T670, LSY T670, LOP T670, LYG T670 LG T671, LOG T671, LSG T671 LB T673, LV T673, LT T673, LW T673 LH T674 LS T676, LA T676, LO T676, LY T676, LB T676, LH T676, LSB T676, LW T676 LB T67C, LV T67C, LT T67C, LS T67K, LO T67K, LY T67K, LW E67C LS E67B, LA E67B, LO E67B, LY E67B, LB E67C, LV E67C, LT E67C LW T67C LS T679, LY T679, LG T679 LS T770, LO T770, LY T770, LG T770, LP T770 LB T773, LV T773, LT T773, LW T773 LH T774 LS E675, LA E675, LY E675, LS T675 LS T776, LA T776, LO T776, LY T776, LB T776 LHGB T686 LT T68C, LB T68C - Hyper Mini TOPLED® LB M676 - Mini TOPLED Santana® LG M470 LS M47K, LO M47K, LY M47K Source: http://www.osram.convergy.de/
PROCESSOR_1 PROCESSOR_2 = stm32:STM32-F405RB
Q1 = transistor-small-signal:BSS123: N-CHANNEL MOS FET
Q3 = adafruit:MOSFET-N: N-Channel Mosfet 2N7002E - 60V 260mA SOT23 [Digikey: 2N7002ET1GOSTR-ND] - REEL BSH103 - 30V 850mA SOT23 [Digikey: 568-5013-1-ND]
R1-R18 R23 R26 R27 R32-R38 = divers:R: Resistor, European symbol
RN1 = resistor-dil:4R-N: Array Chip Resistor Source: RS Component / Phycomp; OC_FARNELL: unknown; OC_NEWARK: unknown
RN4-RN6 = resistor-dil:2R-N: Array Chip Resistor Source: Panasonic; OC_FARNELL: unknown; OC_NEWARK: unknown
TP1-TP11 TP20-TP22 = testpad:PTR1: TEST PIN
U$1 = berlinunited:PS1240P02CT3
U$2 = adafruit:MICROSD: Micro-SD / Transflash card holder with SPI pinout For the 3M # 2908-05WB-MG and/or 4UCON #19656 push-push type
U$3 = berlinunited:BUTTON: http://www.digikey.com/product-detail/en/1.14002.1110000/CKN10402CT-ND/2815589
U$4 = miniIMU-9v2:MINI-IMU-9V2
U$6 = vishay:SI4459ADY: P-Channel-MOSFET 29A 30V SO-8 http://www.digikey.com/product-detail/en/SI4459ADY-T1-GE3/SI4459ADY-T1-GE3CT-ND/1978997
U$7 = texas:SN74LVC1G175
U$8 = berlinunited:LOGO
USB_PROT = usb_esd_protection:VBUS054B: DIGIKEY 751-1453-1-ND; DIGIKEY: 751-1453-1-ND
X1 X4 = con-molex:53?-06: CONNECTOR wire to board 1.25 mm (.049 inch) pitch header; OC_FARNELL: 1125368; OC_NEWARK: unknown
X2 = con-molex:53?-10: CONNECTOR wire to board 1.25 mm (.049 inch) pitch header; OC_FARNELL: unknown; OC_NEWARK: unknown
X3 = con-cypressindustries:MINI-USB-: MINI USB-B Conector Source: www.cypressindustries.com; OC_FARNELL: unknown; OC_NEWARK: unknown
Y1 = microbuilder:CRYSTAL: Crystals HC49UP - Surface Mount Crystal 4.0MHz 18pF +/-30ppm Surface Mount Crystal [Digikey: 535-9857-1-ND] 12.0 MHz Surface Mount Crystal [Digikey: 535-9869-6-ND] 25.0 MHz Surface Mount Crystal [Digikey: 535-9078-1-ND] 3.2 x 2.5mm - MEMs SMT Crystal 12.0 MHz 8pF 15ppm 3.2 x 2.5mm Crystal [Digikey: -10-70°C: 644-1047-1-ND -40-125°C: 644-1128-1-ND] 16.0 MHz 8pF 15ppm 3.2 x 2.5mm Crystal [Digikey: -10-70°C: 644-1049-1-ND -40-125°C: 644-1129-2-ND] 16.0 MHz 10pF 10ppm 3.2 x 2.5mm Crystal [Digikey: 644-1100-1-ND] 27.12 MHz 18pF 30ppm 3.2 x 2.5mm Crystal [Digikey: 887-1424-1-ND] 27.12MHz 10pF 10ppm 3.2 x 2.5mm Crystal [Digikey: 887-1329-1-ND] 4.9 x 1.8mm - MEMs SMT Crystal 32.768 KHz 12.5pF 20ppm 4.9 x 1.8mm Crystal [Digikey: SE2415CT-ND] Cylinder 32.768KHz Cylinder Crystal

## Net classes
0 default: width 0.152 mm, drill 0.203 mm, clearance 0.152 mm
1 supply_bat: width 1.651 mm, drill 0.203 mm, clearance 0.152 mm